# EAGLE schematic kibannISE2024 control (EAGLE 9.6.2)
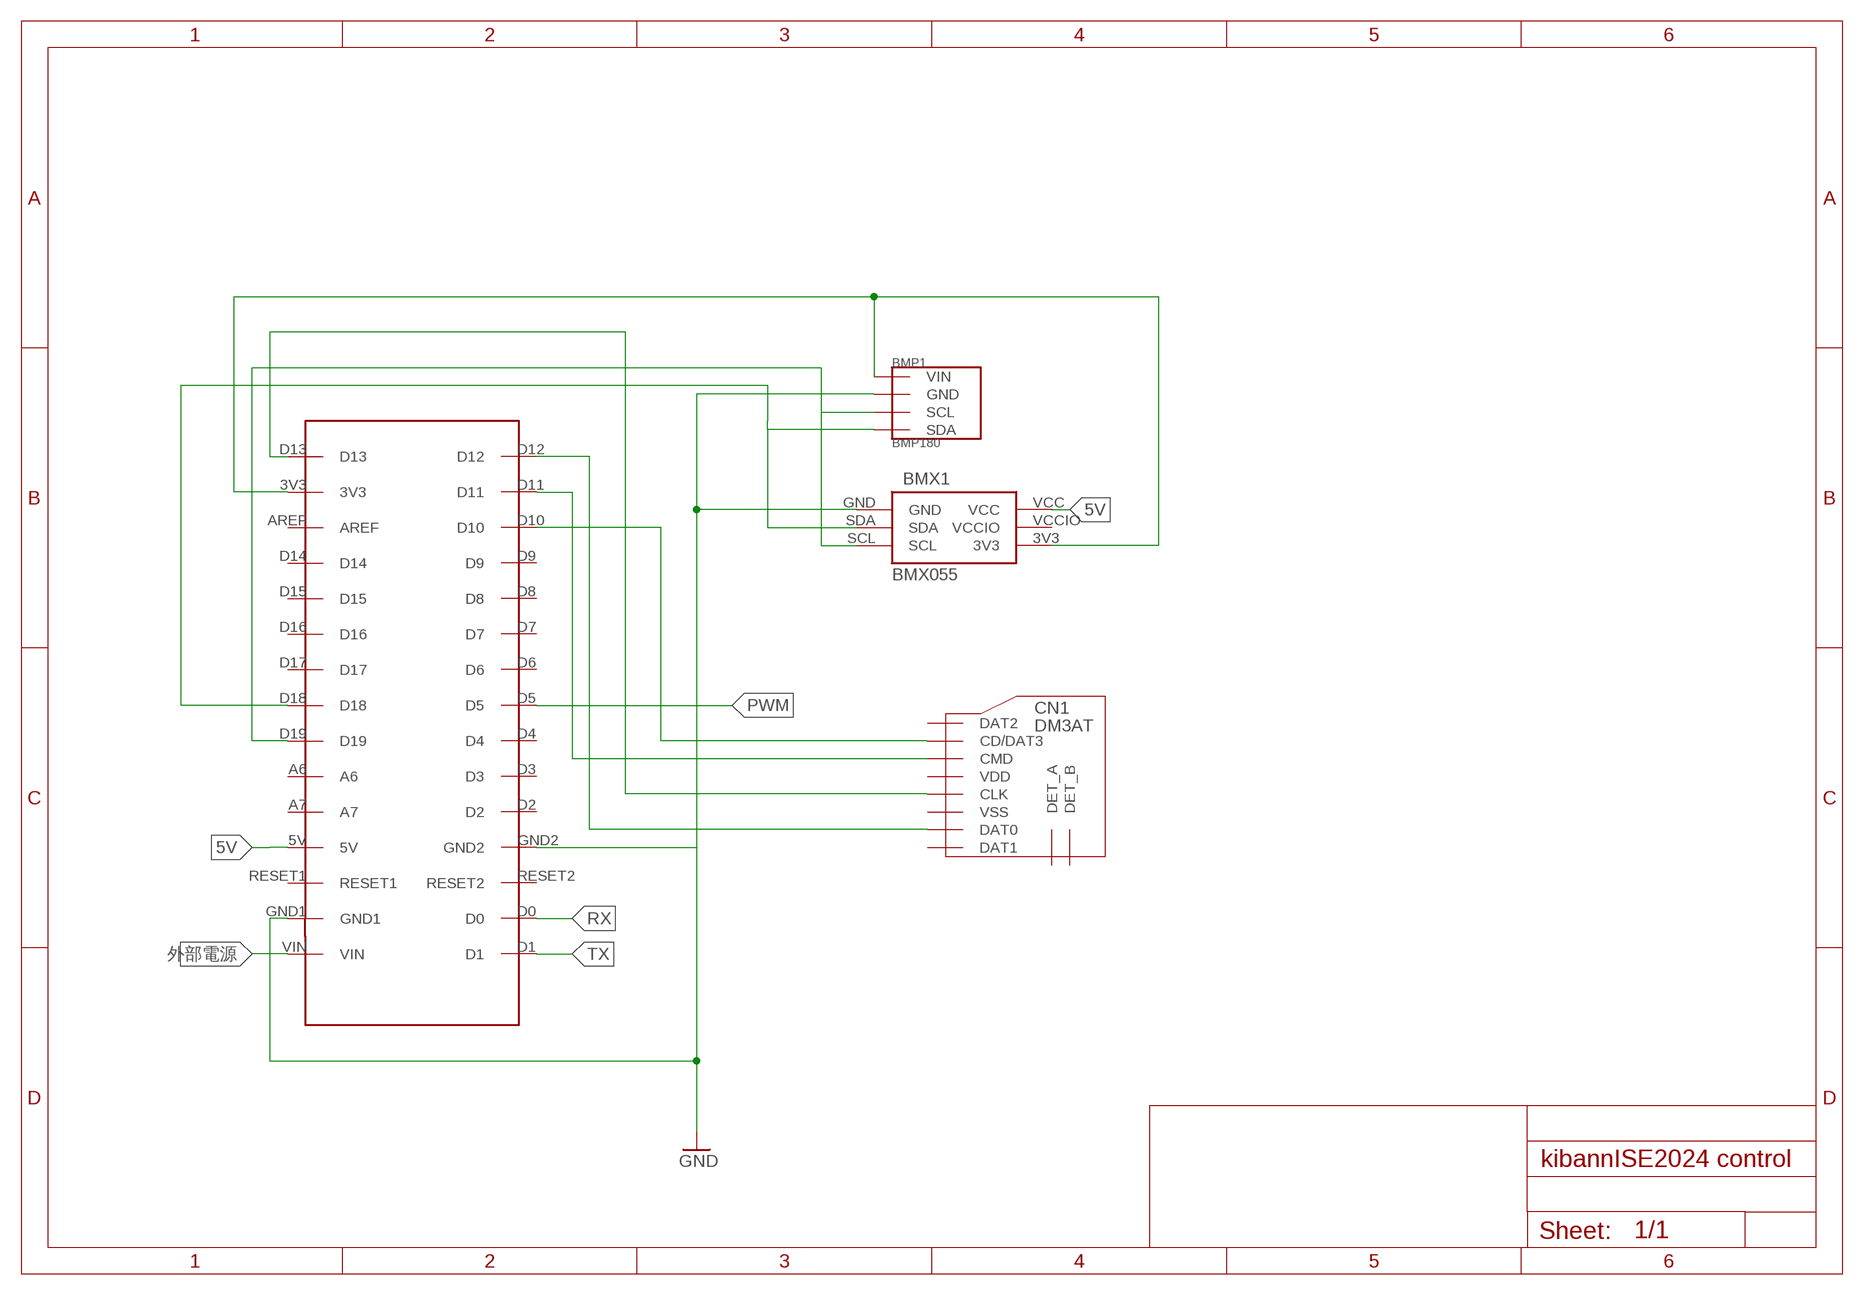
[diagram p0: schematic, sheet 1]

## Parts
BMP1  BMP180  [GY-68]
BMX1  BMX055  [BMX055]
CN1  DM3AT  [DM3AT]
U$1  ARDUINONANO  [ARDUINONANO]

## Nets
5V: BMX1.VCC U$1.5V
GND: BMP1.P2(GND) BMX1.GND U$1.GND1 U$1.GND2
N$1: BMP1.P4(SDA) BMX1.SDA U$1.D18
N$2: BMP1.P3(SCL) BMX1.SCL U$1.D19
N$3: CN1.CLK U$1.D13
N$4: CN1.DAT0 U$1.D12
N$5: CN1.CMD U$1.D11
N$6: CN1.CD/DAT3 U$1.D10
N$7: BMP1.P1(VIN) BMX1.3V3 U$1.3V3
PWM: U$1.D5
RX: U$1.D0
TX: U$1.D1
外部電源: U$1.VIN
Unconnected: CN1.DAT1 CN1.DAT2 CN1.DET_A CN1.DET_B CN1.VDD CN1.VSS U$1.A6 U$1.A7 U$1.AREF U$1.D2 U$1.D3 U$1.D4 U$1.D6 U$1.D7 U$1.D8 U$1.D9 U$1.D14 U$1.D15 U$1.D16 U$1.D17 U$1.RESET1 U$1.RESET2

## Power pins joined to a net without a drawn wire
VCCIO: BMX1.VCCIO

## Library data of the parts
BMP1 = BMP180:BMP180
BMX1 = BMX055:BMX055
CN1 = microSD:DM3AT
U$1 = arduinonano device:ARDUINONANO